# Altium schematic sheet Top.SchDoc: TOP & POWER
size Tabloid; DocumentNumber: MB1137; Revision: B-01; SheetNumber: 1; SheetTotal: 6; Project: NUCLEO-XXXXZX
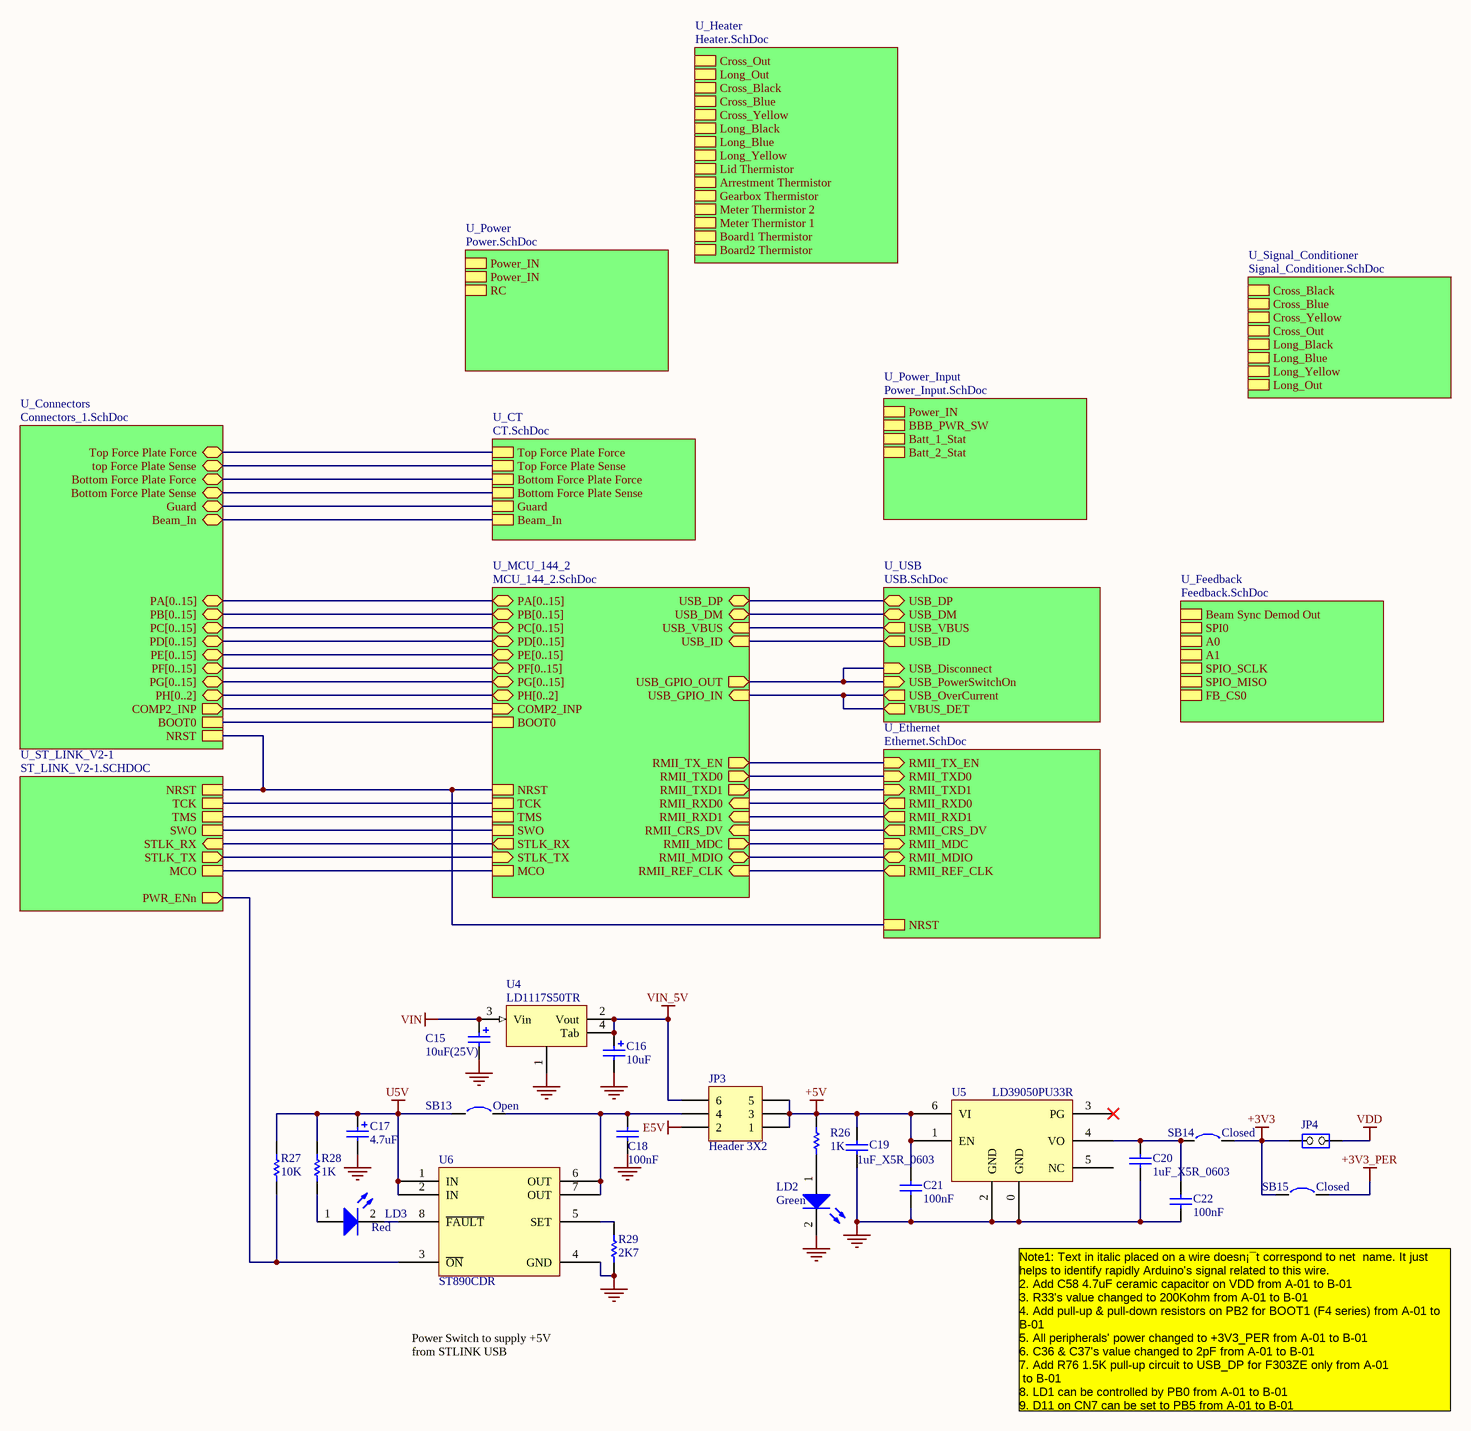
[diagram p0: Top.SchDoc]

## Parts
C15  10uF(25V)  [TAN-B]
C16  10uF  [TAN-A]
C17  4.7uF  [TAN-A]
C18  100nF  [0603C]
C19  1uF_X5R_0603  [0603C]
C20  1uF_X5R_0603  [0603C]
C21  100nF  [0603C]
C22  100nF  [0603C]
JP3  Header 3X2  [HDR_3x2_2R54_V_M]
JP4  (no value)  [HDR_1x2_2R54_V_M_S]
LD2  Green  [0603D-G]
LD3  Red  [0603D-R]
R26  1K  [0603R]
R27  10K  [0603R]
R28  1K  [0603R]
R29  2K7  [0603R]
SB13  Open  [SB_0603]
SB14  Closed  [SB_0603]
SB15  Closed  [SB_0603]
U4  LD1117S50TR  [SOT-223]
U5  LD39050PU33R  [DFN6_0R95_3x3_TP]
U6  ST890CDR  [SOIC8_1R27_4R9X6]

## Sub-sheets
U_Connectors = Connectors_1.SchDoc: PA[0..15] (bidir), PB[0..15] (bidir), PC[0..15] (bidir), NRST, BOOT0, PD[0..15] (bidir), PE[0..15] (bidir), PF[0..15] (bidir), PG[0..15] (bidir), PH[0..2] (bidir), COMP2_INP (out), Top Force Plate Force, top Force Plate Sense, Bottom Force Plate Force, Bottom Force Plate Sense, Guard, Beam_In
U_CT = CT.SchDoc: Top Force Plate Force, Top Force Plate Sense, Bottom Force Plate Force, Bottom Force Plate Sense, Guard, Beam_In
U_Ethernet = Ethernet.SchDoc: RMII_TXD0 (in), RMII_TX_EN (in), RMII_RXD0 (out), RMII_REF_CLK (out), RMII_CRS_DV (out), RMII_MDC (in), RMII_MDIO (bidir), NRST, RMII_TXD1 (in), RMII_RXD1 (out)
U_Feedback = Feedback.SchDoc: Beam Sync Demod Out, SPI0 (harness SPI0), A0, A1, SPIO_SCLK, SPIO_MISO, FB_CS0
U_Heater = Heater.SchDoc: Cross_Out, Long_Out, Cross_Black, Cross_Blue, Cross_Yellow, Long_Black, Long_Blue, Long_Yellow, Lid Thermistor, Arrestment Thermistor, Gearbox Thermistor, Meter Thermistor 2, Meter Thermistor 1, Board1 Thermistor, Board2 Thermistor
U_MCU_144_2 = MCU_144_2.SchDoc: NRST, MCO, STLK_TX (in), STLK_RX (out), PA[0..15] (bidir), PB[0..15] (bidir), PC[0..15] (bidir), TCK, TMS, SWO, BOOT0, PD[0..15] (bidir), PE[0..15] (bidir), PF[0..15] (bidir), PG[0..15] (bidir), PH[0..2] (bidir), USB_DM (bidir), USB_DP (bidir), USB_GPIO_OUT (out), USB_GPIO_IN (in), USB_ID (in), USB_VBUS (in), RMII_TXD0 (out), RMII_TX_EN (out), RMII_RXD0 (in), RMII_REF_CLK (in), RMII_CRS_DV (in), RMII_MDC (out), RMII_MDIO (bidir), RMII_TXD1 (out), RMII_RXD1 (in), COMP2_INP (in)
U_Power = Power.SchDoc: Power_IN, Power_IN, RC
U_Power_Input = Power_Input.SchDoc: Power_IN, BBB_PWR_SW, Batt_1_Stat, Batt_2_Stat
U_Signal_Conditioner = Signal_Conditioner.SchDoc: Cross_Black, Cross_Blue, Cross_Yellow, Cross_Out, Long_Black, Long_Blue, Long_Yellow, Long_Out
U_ST_LINK_V2-1 = ST_LINK_V2-1.SCHDOC: TMS, TCK, MCO, NRST, STLK_RX (in), STLK_TX (out), SWO, PWR_ENn (out)
U_USB = USB.SchDoc: USB_PowerSwitchOn (in), USB_OverCurrent (out), USB_DM (bidir), USB_DP (bidir), USB_ID (out), USB_VBUS (out), USB_Disconnect (in), VBUS_DET (out)

## Nets
+3V3: JP4.1(COMMON) SB14.2 SB15.1
+3V3_PER: SB15.2
+5V: C19.1 C21.2 JP3.1 JP3.3 JP3.5 R26.2 U5.1(EN) U5.6(VI)
E5V: JP3.2
GND: C15.2 C16.2 C17.2 C18.1 C19.2 C20.2 C21.1 C22.1 LD2.2(K) R29.1 U4.1 U5.0(GND) U5.2(GND) U6.4(GND)
U5V: C17.1 R27.1 R28.1 SB13.1 U6.1(IN) U6.2(IN)
VDD: JP4.2(NO)
VIN: C15.1 U4.3(Vin)
VIN_5V: C16.1 JP3.6 U4.2(Vout) U4.4(Tab)
NetC18_2: C18.2 JP3.4 SB13.2 U6.6(OUT) U6.7(OUT)
NetC20_1: C20.1 C22.2 SB14.1 U5.4(VO)
NetLD2_1: LD2.1(A) R26.1
NetLD3_1: LD3.1(A) R28.2
NetLD3_2: LD3.2(K) U6.8(~{FAULT})
NetR27_2: R27.2 U6.3(~{ON}) ; sheet U_ST_LINK_V2-1/PWR_ENn
NetR29_2: R29.2 U6.5(SET)
(unnamed): sheet U_Connectors/NRST, sheet U_ST_LINK_V2-1/NRST, sheet U_Ethernet/NRST, sheet U_MCU_144_2/NRST
(unnamed): sheet U_Connectors/BOOT0, sheet U_MCU_144_2/BOOT0
(unnamed): sheet U_Connectors/COMP2_INP, sheet U_MCU_144_2/COMP2_INP
(unnamed): sheet U_Connectors/Top Force Plate Force, sheet U_CT/Top Force Plate Force
(unnamed): sheet U_Connectors/top Force Plate Sense, sheet U_CT/Top Force Plate Sense
(unnamed): sheet U_Connectors/Bottom Force Plate Force, sheet U_CT/Bottom Force Plate Force
(unnamed): sheet U_Connectors/Bottom Force Plate Sense, sheet U_CT/Bottom Force Plate Sense
(unnamed): sheet U_Connectors/Guard, sheet U_CT/Guard
(unnamed): sheet U_Connectors/Beam_In, sheet U_CT/Beam_In
(unnamed): sheet U_ST_LINK_V2-1/TMS, sheet U_MCU_144_2/TMS
(unnamed): sheet U_ST_LINK_V2-1/TCK, sheet U_MCU_144_2/TCK
(unnamed): sheet U_ST_LINK_V2-1/MCO, sheet U_MCU_144_2/MCO
(unnamed): sheet U_ST_LINK_V2-1/STLK_RX, sheet U_MCU_144_2/STLK_RX
(unnamed): sheet U_ST_LINK_V2-1/STLK_TX, sheet U_MCU_144_2/STLK_TX
(unnamed): sheet U_ST_LINK_V2-1/SWO, sheet U_MCU_144_2/SWO
(unnamed): sheet U_Ethernet/RMII_TXD0, sheet U_MCU_144_2/RMII_TXD0
(unnamed): sheet U_Ethernet/RMII_TX_EN, sheet U_MCU_144_2/RMII_TX_EN
(unnamed): sheet U_Ethernet/RMII_RXD0, sheet U_MCU_144_2/RMII_RXD0
(unnamed): sheet U_Ethernet/RMII_REF_CLK, sheet U_MCU_144_2/RMII_REF_CLK
(unnamed): sheet U_Ethernet/RMII_CRS_DV, sheet U_MCU_144_2/RMII_CRS_DV
(unnamed): sheet U_Ethernet/RMII_MDC, sheet U_MCU_144_2/RMII_MDC
(unnamed): sheet U_Ethernet/RMII_MDIO, sheet U_MCU_144_2/RMII_MDIO
(unnamed): sheet U_Ethernet/RMII_TXD1, sheet U_MCU_144_2/RMII_TXD1
(unnamed): sheet U_Ethernet/RMII_RXD1, sheet U_MCU_144_2/RMII_RXD1
(unnamed): sheet U_MCU_144_2/USB_DM, sheet U_USB/USB_DM
(unnamed): sheet U_MCU_144_2/USB_DP, sheet U_USB/USB_DP
(unnamed): sheet U_MCU_144_2/USB_GPIO_OUT, sheet U_USB/USB_PowerSwitchOn, sheet U_USB/USB_Disconnect
(unnamed): sheet U_MCU_144_2/USB_GPIO_IN, sheet U_USB/USB_OverCurrent, sheet U_USB/VBUS_DET
(unnamed): sheet U_MCU_144_2/USB_ID, sheet U_USB/USB_ID
(unnamed): sheet U_MCU_144_2/USB_VBUS, sheet U_USB/USB_VBUS

Not connected (* = marked no-connect by the designer): U5 3(PG)* 5(NC)

## Buses and harness runs
bus sheet U_Connectors/PA[0..15] = sheet U_MCU_144_2/PA[0..15]
bus sheet U_Connectors/PB[0..15] = sheet U_MCU_144_2/PB[0..15]
bus sheet U_Connectors/PC[0..15] = sheet U_MCU_144_2/PC[0..15]
bus sheet U_Connectors/PD[0..15] = sheet U_MCU_144_2/PD[0..15]
bus sheet U_Connectors/PE[0..15] = sheet U_MCU_144_2/PE[0..15]
bus sheet U_Connectors/PF[0..15] = sheet U_MCU_144_2/PF[0..15]
bus sheet U_Connectors/PG[0..15] = sheet U_MCU_144_2/PG[0..15]
bus sheet U_Connectors/PH[0..2] = sheet U_MCU_144_2/PH[0..2]

## Notes on the sheet
- Power Switch to supply +5V from STLINK USB
- Note1: Text in italic placed on a wire doesn¡¯t correspond to net  name. It just helps to identify rapidly Arduino's signal related to this wire.
  2. Add C58 4.7uF ceramic capacitor on VDD from A-01 to B-01
  3. R33's value changed to 200Kohm from A-01 to B-01
  4. Add pull-up & pull-down resistors on PB2 for BOOT1 (F4 series) from A-01 to B-01
  5. All peripherals' power changed to +3V3_PER from A-01 to B-01
  6. C36 & C37's value changed to 2pF from A-01 to B-01
  7. Add R76 1.5K pull-up circuit to USB_DP for F303ZE only from A-01
  to B-01
  8. LD1 can be controlled by PB0 from A-01 to B-01
  9. D11 on CN7 can be set to PB5 from A-01 to B-01
- Title
- Size:
- Date:
- Tabloid
- Number:
- Time:
- Revision:
- Sheet
- of
- ZLS Corporation
- 7801 North Lamar Blvd.
- Suite E-184
- Austin, Texas 78752  USA
- (512) 453-0288
- File:

## Library data of the parts
C15 C16 = Cap Pol1: Polarized Capacitor (Radial); Published: 8-Jun-2000; Revision: July-2002: Re-released for DXP Platform.; Publisher: Altium Limited; Value: 10uF
C17 = Cap Pol1: Polarized Capacitor (Radial); Value: 100pF; Ordered by: Subcon; Published: 8-Jun-2000; Revision: July-2002: Re-released for DXP Platform.; Publisher: Altium Limited
C18 C21 C22 = Capacitor_ST: Capacitor 0402 / 0603 / 0805; Revision: July-2002: Re-released for DXP Platform.; Value: 100nF
C19 C20 = CAP SMD 0603  X5R 1µF 25V 10%: 0603  X5R 1µF; Rated voltage: 25V; Tolerance: 10%; Manufacturer: *; Manufacturer P/N: *; Order code Farnell: 1288202RL; Value: 1µF; Power: *; Technology: X5R; Temperature  Factor: *; Temperature Max: +125°C; Temperature Min: -55°C; STS Code: *
JP3 = Header 3X2: Header, 3-Pin, Dual row; Revision: 17-Jul-2002: Re-released for DXP Platform.; Publisher: Altium Limited
JP4 = JP2
LD2 LD3 = LED2: Typical RED, GREEN, YELLOW, AMBER GaAs LED; Published: 8-Jun-2000; Revision: July-2002: Re-released for DXP Platform.; Publisher: Altium Limited
R26 R29 = Resistor_ST: Resistor 0402 / 0603 / 0805; Value: 10K
R27 = Resistor_ST: Resistor 0402 / 0603 / 0805; Value: 10K
R28 = Res1: Resistor; Ordered by: Subcon; Published: 8-Jun-2000; Revision: July-2002: Re-released for DXP Platform.; Publisher: Altium Limited; Value: 1K
SB13 = Circuit Breaker: Published: 24-Mar-1999; Revision: July-2002: Re-released for DXP Platform.; Publisher: Altium Limited
SB14 SB15 = Circuit Breaker_close: Circuit Breaker; Published: 24-Mar-1999; Revision: July-2002: Re-released for DXP Platform.; Publisher: Altium Limited
U4 = LD1117
U5 = LD39050P